# Altium schematic sheet 1_ESP32Main.schdoc
size 309 x 223 mm; Symbol: Sheet-Symbol_A4; Device: Sheet-Symbol_A4; Company: 嘉立创EDA; Version: V1.0; Page Size: A4; @Project Name: MyESP32CardReader; @Page Count: 2; @Update Date: 2024-08-08; @Create Date: 2024-06-24; @Schematic Name: Schematic1; @Page No: 1; @Page Name: ESP32Main; @Board Name: Board1; @Create Time: 22:54:17; @Update Time: 20:30:47
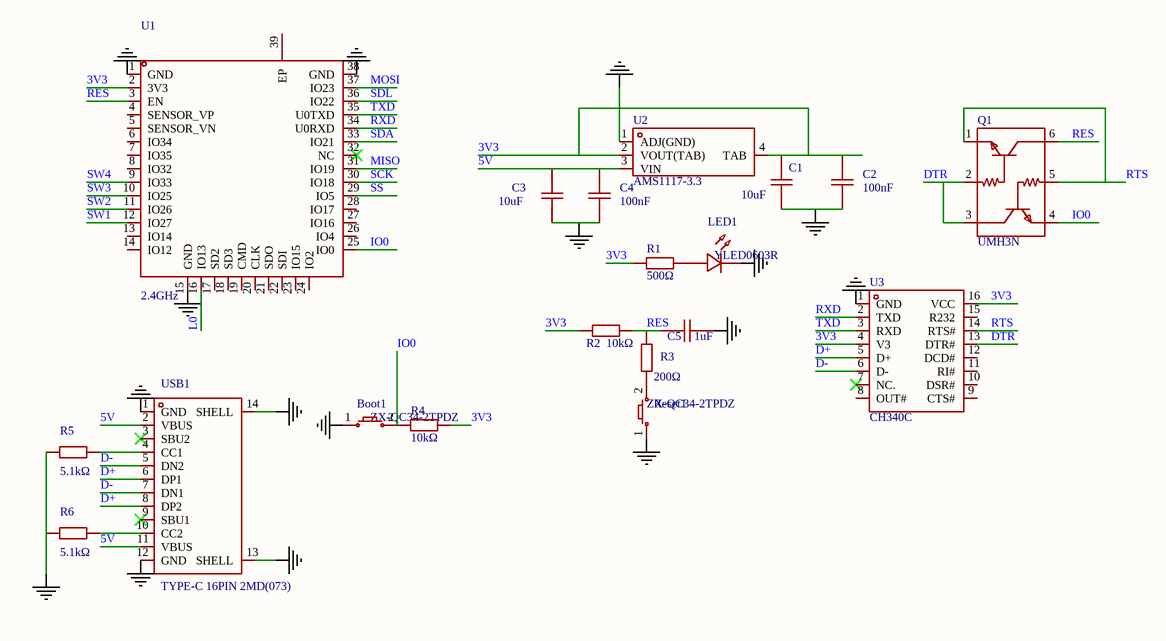
[diagram p0: 1_ESP32Main.schdoc]

## Parts
Boot1  ZX-QC34-2TPDZ  [KEY-SMD_L3.9-W3.0-LS5.0-EH]  (value not drawn)
C1  10uF  [C0603]  (value not drawn)
C2  100nF  [C0603]  (value not drawn)
C3  10uF  [C0603]  (value not drawn)
C4  100nF  [C0603]  (value not drawn)
C5  1uF  [C0603]  (value not drawn)
LED1  YLED0603R  [LED0603-FD]  (value not drawn)
Q1  UMH3N  [SC-70-6_L2.2-W1.3-P0.65-LS2.1-BR]  (value not drawn)
R1  500Ω  [R0603]  (value not drawn)
R2  10kΩ  [R0603]  (value not drawn)
R3  200Ω  [R0603]  (value not drawn)
R4  10kΩ  [R0603]  (value not drawn)
R5  5.1kΩ  [R0603]  (value not drawn)
R6  5.1kΩ  [R0603]  (value not drawn)
Reset1  ZX-QC34-2TPDZ  [KEY-SMD_L3.9-W3.0-LS5.0-EH]  (value not drawn)
U1  2.4GHz  [WIRELM-SMD_ESP32-S]  (value not drawn)
U2  AMS1117-3.3  [SOT-223-4_L6.5-W3.5-P2.30-LS7.0-BR]  (value not drawn)
U3  CH340C  [SOP-16_L10.0-W3.9-P1.27-LS6.0-BL]  (value not drawn)
USB1  TYPE-C 16PIN 2MD(073)  [USB-C-SMD_TYPE-C-6PIN-2MD-073]  (value not drawn)

## Nets
GND: Boot1.1 C1.2 C2.1 C3.1 C4.1 C5.2 LED1.1(C) R5.1 R6.1 Reset1.1 U1.1(GND) U1.15(GND) U1.38(GND) U2.1(ADJ(GND)) U3.1(GND) USB1.1(GND) USB1.12(GND) USB1.13(SHELL) USB1.14(SHELL)
3V3: C1.1 C2.2 R1.1 R2.1 R4.2 U1.2(3V3) U2.2(VOUT(TAB)) U2.4(TAB) U3.4(V3) U3.16(VCC)
5V: C3.2 C4.2 U2.3(VIN) USB1.2(VBUS) USB1.11(VBUS)
D+: U3.5(D+) USB1.6(DP1) USB1.8(DP2)
D-: U3.6(D-) USB1.5(DN2) USB1.7(DN1)
DTR: Q1.2(B) Q1.3(C) U3.13(DTR#)
IO0: Boot1.2 Q1.4(E) R4.1 U1.25(IO0)
L0: U1.16(IO13)
MISO: U1.31(IO19)
MOSI: U1.37(IO23)
RES: C5.1 Q1.6(C) R2.2 R3.2 U1.3(EN)
RTS: Q1.1(E) Q1.5(B) U3.14(RTS#)
RXD: U1.34(U0RXD) U3.2(TXD)
SCK: U1.30(IO18)
SDA: U1.33(IO21)
SDL: U1.36(IO22)
SS: U1.29(IO5)
SW1: U1.12(IO27)
SW2: U1.11(IO26)
SW3: U1.10(IO25)
SW4: U1.9(IO33)
TXD: U1.35(U0TXD) U3.3(RXD)
NetLED1_2: LED1.2(A) R1.2
NetR3_1: R3.1 Reset1.2
NetR5_2: R5.2 USB1.4(CC1)
NetR6_2: R6.2 USB1.10(CC2)

Not connected (* = marked no-connect by the designer): U1 4(SENSOR_VP) 5(SENSOR_VN) 6(IO34) 7(IO35) 8(IO32) 13(IO14) 14(IO12) 17(SD2) 18(SD3) 19(CMD) 20(CLK) 21(SDO) 22(SDI) 23(IO15) 24(IO2) 26(IO4) 27(IO16) 28(IO17) 32(NC)* 39(EP); U3 7(NC.)* 8(OUT#) 9(CTS#) 10(DSR#) 11(RI#) 12(DCD#) 15(R232); USB1 3(SBU2)* 9(SBU1)*

## Notes on the sheet
- 1
- 2
- 3
- 4
- 5
- 6
- A
- B
- C
- 原理图
- Schematic1
- 创建日期
- 更新日期
- 2024-08-08
- 2024-06-24
- 审阅
- 绘制
- 图页
- ESP32Main
- 物料编码
- MyESP32CardReader
- D
- 版本
- 尺寸
- 页
- 共
- V1.0
- A4
- 嘉立创EDA

## Library data of the parts
Boot1 Reset1 = ZX-QC34-2TPDZ: 电路结构:单刀单掷;按钮形状:圆形按钮;作用力:2.6N;安装方式:立贴;开关长度:3mm;开关宽度:4mm;开关高度:2mm;带支架:不带;触点电流:50mA;额定电压(AC):250V;额定电压(DC):12V;绝缘电阻:100MΩ;机械寿命:10万次;; Manufacturer: Megastar(兆星); Symbol: 轻触按键x2; Add into BOM: yes; Circuit: 单刀单掷; Actuator Style: 圆形按钮; Operating Force: 2.6N; Switch Length: 3mm; Switch Width: 4mm; Switch Height: 2mm; Strike Gundam: 不带; Contact Current: 50mA; Voltage Rating (AC): 250V; Voltage Rating (DC): 12V; Insulation Resistance: 100MΩ; Actuator/Cap Color: 黑色; Pin Style: 鸥翼型; Mechanical Life: 10万次; Device: ZX-QC34-2TPDZ; LCSC Part Name: 3*4*2贴片开关带柱; Supplier Part: C7470219; Manufacturer Part: ZX-QC34-2TPDZ; Supplier Footprint: SMD; JLCPCB Part Class: Extended Part; Datasheet: https://atta.szlcsc.com/upload/public/pdf/source/20230724/D2731FAADF93973E25928DE23F241F8A.pdf; Supplier: LCSC; Convert to PCB: yes; Mounting Style: 立贴; Operating Temperature: -30℃~+80℃
C1 C3 = CL10A106MA8NRNC: 容值:10uF;精度:±20%;额定电压:25V;材质(温度系数):X5R;; Manufacturer: SAMSUNG(三星); Symbol: CapAcitance; Add into BOM: yes; Tolerance: ±20%; Voltage Rated: 25V; Temperature Coefficient: X5R; Device: CL10A106MA8NRNC; LCSC Part Name: 10uF ±20% 25V; Supplier Part: C96446; Manufacturer Part: CL10A106MA8NRNC; Supplier Footprint: 0603; JLCPCB Part Class: Basic Part; Datasheet: https://atta.szlcsc.com/upload/public/pdf/source/20160218/1457707763339.pdf; Supplier: LCSC; Convert to PCB: yes; Value: 10uF
C2 C4 = CGA0603X7R104K500JT: 容值:100nF;精度:±10%;额定电压:50V;材质(温度系数):X7R;; Manufacturer: HRE(芯声); Symbol: CapAcitance; Add into BOM: yes; Tolerance: ±10%; Voltage Rated: 50V; Temperature Coefficient: X7R; Device: CGA0603X7R104K500JT; LCSC Part Name: 100nF ±10% 50V; Supplier Part: C6119867; Manufacturer Part: CGA0603X7R104K500JT; Supplier Footprint: 0603; JLCPCB Part Class: Extended Part; Supplier: LCSC; Convert to PCB: yes; Value: 100nF
C5 = CL10A105KB8NNNC: 容值:1uF;精度:±10%;额定电压:50V;材质(温度系数):X5R;; Manufacturer: SAMSUNG(三星); Symbol: CapAcitance; Add into BOM: yes; Tolerance: ±10%; Voltage Rated: 50V; Temperature Coefficient: X5R; Device: CL10A105KB8NNNC; LCSC Part Name: 1uF ±10% 50V; Supplier Part: C15849; Manufacturer Part: CL10A105KB8NNNC; Supplier Footprint: 0603; JLCPCB Part Class: Basic Part; Datasheet: https://atta.szlcsc.com/upload/public/pdf/source/20160218/1457707763339.pdf; Supplier: LCSC; Convert to PCB: yes; Value: 1uF
LED1 = YLED0603R: 发光颜色:红色;正向电压(VF):1.8V~2.4V;功率:-;正向电流:25mA;主波长:620nm~625nm;二极管配置:-;透镜颜色:-;色温:-;发光强度:-;发光角度:-;载带方式:-;工作温度:-40℃~+85℃;; Manufacturer: YONGYUTAI(永裕泰); Symbol: LED_R; Convert to PCB: yes; Emitted Color: 红色; Forward Current: 25mA; Device: YLED0603R; Add into BOM: yes; Supplier Footprint: 0603; Supplier Part: C19171390; JLCPCB Part Class: Extended Part; LCSC Part Name: YLED0603R; Manufacturer Part: YLED0603R; Datasheet: https://atta.szlcsc.com/upload/public/pdf/source/20231027/FB19AF06E2C70028E58AB5CEDD1BDC72.pdf; Supplier: LCSC; Forward Voltage (VF): 1.8V~2.4V; Power Dissipation: -; Dominant Wavelength: 620nm~625nm; Peak Wavelength: -; Diode Configuration: -; Lens Color: -; Color Temperature: -; Luminous Intensity: -; Viewing Angle: -; Mounting Sytle: -; Operating Temperature: -40℃~+85℃
Q1 = UMH3N: 晶体管类型:2个NPN-预偏置;集射极击穿电压(Vceo):50V;集电极电流(Ic):100mA;功率(Pd):150mW;; Manufacturer: CJ(江苏长电/长晶); Add into BOM: yes; Collector-Emitter Breakdown Voltage (Vceo): 50V; Collector Current (Ic): 100mA; Power Dissipation (Pd): 150mW; Symbol: UMH3N; Device: UMH3N; LCSC Part Name: 电流:100mA 耐压:50V; Supplier Part: C62892; Manufacturer Part: UMH3N; Supplier Footprint: SC-70-6(SOT-363); JLCPCB Part Class: 扩展库; Datasheet: https://atta.szlcsc.com/upload/public/pdf/source/20151109/1457707575095.pdf; Supplier: LCSC; Convert to PCB: yes; Transistor Type: 2个NPN-预偏置
R1 = RT0603BRC07500RL: 电阻类型:薄膜电阻;阻值:500Ω;精度:±0.1%;功率:100mW;温度系数:±15ppm/℃;; Manufacturer: YAGEO(国巨); Symbol: 电阻; Add into BOM: yes; Tolerance: ±0.1%; Power(Watts): 100mW; Device: RT0603BRC07500RL; LCSC Part Name: 薄膜电阻 500Ω ±0.1% 100mW; Supplier Part: C860931; Manufacturer Part: RT0603BRC07500RL; Supplier Footprint: 0603; JLCPCB Part Class: Extended Part; Supplier: LCSC; Convert to PCB: yes; Type: 薄膜电阻; Value: 500Ω; Temperature Coefficient: ±15ppm/℃; Operating Temperature Range: -55℃~+155℃
R2 R4 = FRC0603J103TS: 电阻类型:厚膜电阻;阻值:10kΩ;精度:±5%;功率:100mW;最大工作电压:75V;温度系数:±100ppm/℃;; Manufacturer: FOJAN(富捷); Symbol: 电阻; Add into BOM: yes; Tolerance: ±5%; Power(Watts): 100mW; Overload Voltage (Max): 75V; Device: FRC0603J103TS; LCSC Part Name: 10kΩ ±5% 100mW 厚膜电阻; Supplier Part: C2930027; Manufacturer Part: FRC0603J103TS; Supplier Footprint: 0603; JLCPCB Part Class: Extended Part; Datasheet: https://atta.szlcsc.com/upload/public/pdf/source/20211221/925EC7D7225764EE0046F22065062C87.pdf; Supplier: LCSC; Convert to PCB: yes; Type: 厚膜电阻; Value: 10kΩ; Temperature Coefficient: ±100ppm/℃; Operating Temperature Range: -55℃~+155℃
R3 = 0603WAF2000T5E: 电阻类型:厚膜电阻;阻值:200Ω;精度:±1%;功率:100mW;最大工作电压:75V;温度系数:±100ppm/℃;; Manufacturer: UNI-ROYAL(厚声); Symbol: 电阻; Add into BOM: yes; Tolerance: ±1%; Power(Watts): 100mW; Overload Voltage (Max): 75V; Device: 0603WAF2000T5E; LCSC Part Name: 200Ω ±1% 100mW 厚膜电阻; Supplier Part: C8218; Manufacturer Part: 0603WAF2000T5E; Supplier Footprint: 0603; JLCPCB Part Class: Basic Part; Datasheet: https://atta.szlcsc.com/upload/public/pdf/source/20200306/C422600_1E6D84923E4A46A82E41ADD87F860B5C.pdf; Supplier: LCSC; Convert to PCB: yes; Type: 厚膜电阻; Value: 200Ω; Temperature Coefficient: ±100ppm/℃; Operating Temperature Range: -55℃~+155℃
R5 R6 = 0603WAF5101T5E: 电阻类型:厚膜电阻;阻值:5.1kΩ;精度:±1%;功率:100mW;最大工作电压:75V;温度系数:±100ppm/℃;; Manufacturer: UNI-ROYAL(厚声); Symbol: 电阻; Add into BOM: yes; Tolerance: ±1%; Power(Watts): 100mW; Overload Voltage (Max): 75V; Device: 0603WAF5101T5E; LCSC Part Name: 5.1kΩ ±1% 100mW 厚膜电阻; Supplier Part: C23186; Manufacturer Part: 0603WAF5101T5E; Supplier Footprint: 0603; JLCPCB Part Class: Basic Part; Datasheet: https://atta.szlcsc.com/upload/public/pdf/source/20200306/C422600_1E6D84923E4A46A82E41ADD87F860B5C.pdf; Supplier: LCSC; Convert to PCB: yes; Type: 厚膜电阻; Value: 5.1kΩ; Temperature Coefficient: ±100ppm/℃; Operating Temperature Range: -55℃~+155℃
U1 = ESP32-S: 核心处理器:ESP32芯片;频率:2.4GHz;天线形式:IPEX接口;发射功率:17dBm;接收灵敏度:-90dBm;; Manufacturer: Ai-Thinker(安信可); Add into BOM: yes; Support Interface: I2C；UART；DAC；SPI；PWM；ADC; Antenna Type: IPEX接口; Output Power: 17dBm; Operating Voltage: 3.3V; Sensitivity: -90dBm; Symbol: ESP32-S; Device: ESP32-S; LCSC Part Name: ESP32-S; Supplier Part: C277944; Manufacturer Part: ESP32-S; Supplier Footprint: SMD; JLCPCB Part Class: 扩展库; Datasheet: https://atta.szlcsc.com/upload/public/pdf/source/20211217/F4BEA33E732D6002D10DAED85BBCB52B.pdf; Supplier: LCSC; Convert to PCB: yes; Core Processor: ESP32芯片; Wireless Standard: -; Value: 2.4GHz; Receive  Current: -; Send  Current: -; Operating Temperature: -40℃~+85℃
U2 = AMS1117-3.3_C347222: 输出类型:固定;最大输入电压:12V;输出电压:3.3V;最大输出电流:1A;电源纹波抑制比(PSRR):60dB@(120Hz);输出极性:正极;; Manufacturer: UMW(友台半导体); Add into BOM: yes; Output Type: 固定; Maximum Input Voltage: 12V; Output Voltage: 3.3V; MAX Output Current: 1A; Dropout Voltage: 1.3V@(1A); Output Polarity: 正极; Number of Outputs: 1; Symbol: AMS1117-3.3_C347222; Device: AMS1117-3.3_C347222; LCSC Part Name: 输出:3.3V 电流:1A 耐压:12V; Supplier Part: C347222; Manufacturer Part: AMS1117-3.3; Supplier Footprint: SOT-223; JLCPCB Part Class: 扩展库; Datasheet: https://atta.szlcsc.com/upload/public/pdf/source/20231109/155D79A26D9DB04352555A58D5969DC8.pdf; Supplier: LCSC; Convert to PCB: yes; Power Supply Rejection Ratio (PSRR): 60dB@(120Hz); standby current: -; Noise: -; Feature: -; Operating Temperature: -
U3 = CH340C: 应用功能:收发器;接口协议:USB 2.0;数据速率:2Mbps;; Manufacturer: WCH(南京沁恒); Add into BOM: yes; Applications Function: 收发器; Protocol: USB 2.0; Supply Voltage: 3.3V；5V; Data Rate: 2Mbps; Symbol: CH340C; Device: CH340C; Supplier: LCSC; Manufacturer Part: CH340C; Supplier Part: C84681; JLCPCB Part Class: 扩展库; LCSC Part Name: CH340C USB转串口芯片 CH340; Supplier Footprint: SOP-16; Datasheet: https://atta.szlcsc.com/upload/public/pdf/source/20200819/C84681_ADBED554CE321879DBD6B1D06488689C.pdf; Convert to PCB: yes
USB1 = TYPE-C 16PIN 2MD(073): 连接器类型:Type-C;标准:USB 3.1;公母:母;安装方式:卧贴;触点数量:16P;端口数量:1;额定电流 - 电源:5A;工作温度范围:-25℃~+85℃;; Manufacturer: SHOU HAN(首韩); Add into BOM: yes; Gender: 母; Number of Contacts: 16P; Number of Ports: 1; Current Rating - Power (Max): 5A; Rated Voltage (Max): 5V; Connect-Disconnect Life: 5千次; Core Colour: 黑色; Symbol: TYPE-C 16PIN 2MD(073); Device: TYPE-C 16PIN 2MD(073); LCSC Part Name: Type-C 母 卧贴; Supplier Part: C2765186; Manufacturer Part: TYPE-C 16PIN 2MD(073); Supplier Footprint: SMD; JLCPCB Part Class: 扩展库; Datasheet: https://atta.szlcsc.com/upload/public/pdf/source/20211123/39B17C16241EAC15C5E277BDA434118E.pdf; Supplier: LCSC; Convert to PCB: yes; Connector Type: Type-C; Standard: USB 3.1; Mounting Style: 卧贴; Operating Temperature Range: -25℃~+85℃